# Altium schematic sheet PWMsch.SchDoc
size A2
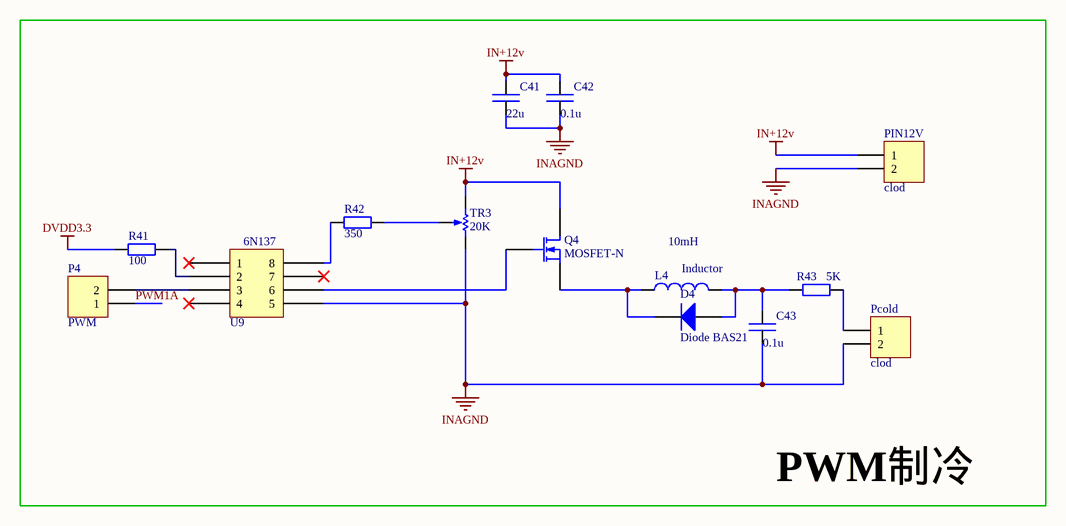
[diagram p0: PWMsch.SchDoc]

## Parts
C41  22u  [4*4.5 贴片电解电容]
C42  0.1u  [0805]
C43  0.1u  [0805]
D4  Diode BAS21  [DIODE-SMA]
L4  Inductor  value 10mH  [1206]
P4  PWM  [HDR1X2]
Pcold  clod  [HDR1X2]
PIN12V  clod  [HDR1X2]
Q4  MOSFET-N  [TIP122-带卧式散热]
R41  value 100  [0805]  (hidden comment: Res2)
R42  value 350  [0805]  (hidden comment: Res2)
R43  value 5K  [1206]  (hidden comment: Res2)
TR3  value 20K  [VR5]  (hidden comment: RPot)
U9  6N137  [SOIC8]  (value not drawn)

## Blocks framed on the sheet
PWM制冷: C41-C43 D4 L4 P4 Pcold PIN12V Q4 R41-R43 TR3 U9

## Nets
DVDD3.3: R41.2
IN+12v: C41.1 C42.1 PIN12V.1 Q4.2(D) TR3.1(TOP)
INAGND: C41.2 C42.2 C43.2 Pcold.2 PIN12V.2 TR3.3(BOT) U9.5
PWM1A: P4.1
NetC43_1: C43.1 D4.1(A) L4.2 R43.1
NetD4_3: D4.3(K) L4.1 Q4.3(S)
NetP4_2: P4.2 U9.3
NetPcold_1: Pcold.1 R43.2
NetQ4_1: Q4.1(G) U9.6
NetR41_1: R41.1 U9.2
NetR42_1: R42.1 TR3.2(TAP)
NetR42_2: R42.2 U9.8

Not connected (* = marked no-connect by the designer): U9 1* 4* 7*

## Library data of the parts
C41-C43 = Cap
D4 = Diode BAS21: Silicon Switching Diode for High-Speed, High-Voltage Switching; Note: Pin 2 is not connected and not drawn.; Published: 21-Mar-2003; DatasheetDocument: Oct-1999; PackageDocument: Sep-2001; PackageReference: SOT-23; Publisher: Altium Limited; ComponentLink1Description: Manufacturer Link; ComponentLink1URL: http://www.infineon.com/; ComponentLink2Description: Datasheet; ComponentLink2URL: http://www.infineon.com/upload/Document/cmc_upload/documents/080/812/bas21series.pdf
L4 = Inductor: Code_IEC: 1005; Published: 8-Jun-2000; LatestRevisionDate: 17-Jul-2002; LatestRevisionNote: Re-released for DXP Platform.; PackageReference: 0402-A; Publisher: Altium Limited; Code_JEITA: 0402
P4 Pcold PIN12V = Header 2: Header, 2-Pin; LatestRevisionDate: 17-Jul-2002; LatestRevisionNote: Re-released for DXP Platform.; Publisher: Altium Limited
Q4 = MOSFET-N: N-Channel MOSFET; PackageDocument: 1995/1996; Published: 8-Jun-2000; LatestRevisionDate: 17-Jul-2002; LatestRevisionNote: Re-released for DXP Platform.; PackageReference: E3; Publisher: Altium Limited
R41-R43 = Res2: Resistor; Published: 8-Jun-2000; LatestRevisionDate: 17-Jul-2002; LatestRevisionNote: Re-released for DXP Platform.; PackageReference: AXIAL-0.4; Publisher: Altium Limited
TR3 = RPot: Potentiometer; Sim Note: Enter the Resistance value and the set point into parameter fields.; Set Position: 0.5; Published: 8-Jun-2000; LatestRevisionDate: 17-Jul-2002; LatestRevisionNote: Re-released for DXP Platform.; PackageReference: VR5; Publisher: Altium Limited